# Altium schematic sheet Microcontroller.SchDoc
size A
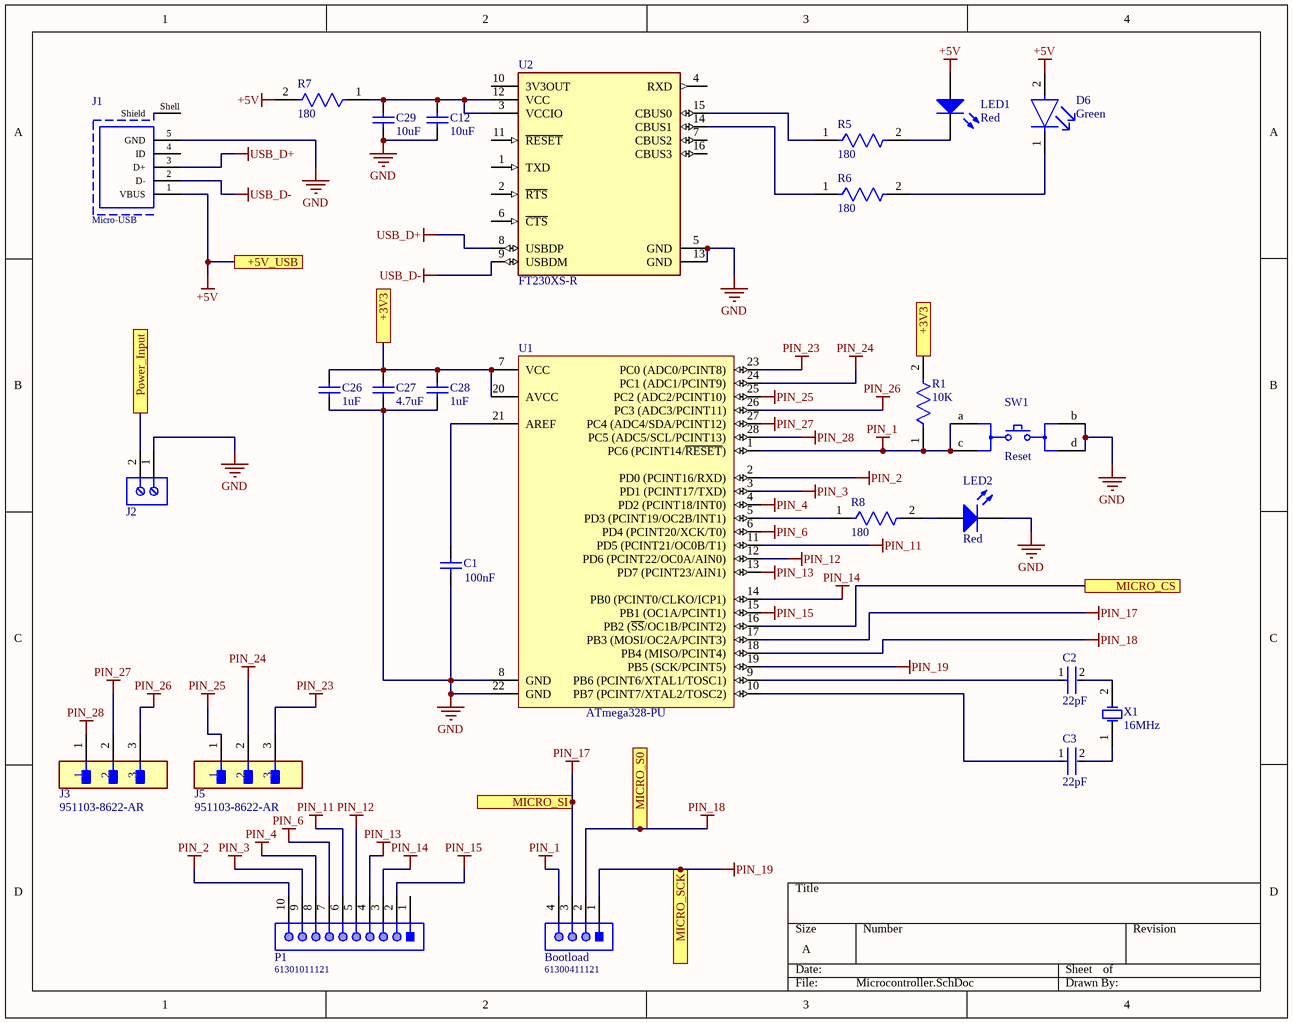
[diagram p0: Microcontroller.SchDoc]

## Parts
Bootload  61300411121  [61300411121]
C1  100nF  [CAPC2013X140X50NL20T25]
C2  22pF  [FP-C0805C-DN-MFG]
C3  22pF  [FP-C0805C-DN-MFG]
C12  10uF  [CAPC2013X115X51LL20T26]
C26  1uF  [CAPC2013X94X50LL20T25]
C27  4.7uF  [CAPC2013X140X50LL20T25]
C28  1uF  [CAPC2013X94X50LL20T25]
C29  10uF  [CAPC2013X115X51LL20T26]
D6  Green  [FP-APTD3216CGCK-MFG]
J1  Micro-USB  [629105150921]
J2  (no value)  [691214110002]
J3  951103-8622-AR  [FP-951103-8622-AR-MFG]
J5  951103-8622-AR  [FP-951103-8622-AR-MFG]
LED1  Red  [0603_A]
LED2  Red  [0603_A]
P1  61301011121  [61301011121]
R1  10K  [FP-CRCW0805-e3-IPC_A]
R5  180  [FP-CR0805-MFG]
R6  180  [FP-CR0805-MFG]
R7  180  [FP-CR0805-MFG]
R8  180  [FP-CR0805-MFG]
SW1  Reset  [FP-ESE-20C421-MFG]
U1  ATmega328-PU  [28P3]
U2  FT230XS-R  [FP-SSOP-16-MFG]
X1  16MHz  [FOX-FOXSDLF160-20_V]

## Ports
+3V3, +5V_USB, MICRO_CS, MICRO_S0, MICRO_SCK, MICRO_SI, Power_Input

## Nets
+5V: D6.2(A) J1.1(VBUS) LED1.2(A) R7.2 ; port +5V_USB
GND: C1.1 C12.1 C26.1 C27.1 C28.1 C29.1 J1.5(GND) J2.1 LED2.1(K) SW1.b SW1.d U1.8(GND) U1.22(GND) U2.5(GND) U2.13(GND)
PIN_1: Bootload.4 R1.1 SW1.a SW1.c U1.1(PC6_(PCINT14/~{RESET}))
PIN_2: P1.10 U1.2(PD0_(PCINT16/RXD))
PIN_3: P1.9 U1.3(PD1_(PCINT17/TXD))
PIN_4: P1.8 U1.4(PD2_(PCINT18/INT0))
PIN_6: P1.7 U1.6(PD4_(PCINT20/XCK/T0))
PIN_11: P1.6 U1.11(PD5_(PCINT21/OC0B/T1))
PIN_12: P1.5 U1.12(PD6_(PCINT22/OC0A/AIN0))
PIN_13: P1.4 U1.13(PD7_(PCINT23/AIN1))
PIN_14: P1.3 U1.14(PB0_(PCINT0/CLKO/ICP1))
PIN_15: P1.2 U1.15(PB1_(OC1A/PCINT1))
PIN_17: Bootload.3 U1.17(PB3_(MOSI/OC2A/PCINT3)) ; port MICRO_SI
PIN_18: Bootload.2 U1.18(PB4_(MISO/PCINT4)) ; port MICRO_S0
PIN_19: Bootload.1 U1.19(PB5_(SCK/PCINT5)) ; port MICRO_SCK
PIN_23: J5.3 U1.23(PC0_(ADC0/PCINT8))
PIN_24: J5.2 U1.24(PC1_(ADC1/PCINT9))
PIN_25: J5.1 U1.25(PC2_(ADC2/PCINT10))
PIN_26: J3.3 U1.26(PC3_(ADC3/PCINT11))
PIN_27: J3.2 U1.27(PC4_(ADC4/SDA/PCINT12))
PIN_28: J3.1 U1.28(PC5_(ADC5/SCL/PCINT13))
USB_D+: J1.3(D+) U2.8(USBDP)
USB_D-: J1.2(D-) U2.9(USBDM)
+3V3: C26.2 C27.2 C28.2 R1.2 U1.7(VCC) U1.20(AVCC) ; port +3V3
MICRO_CS: U1.16(PB2_(~{SS}/OC1B/PCINT2)) ; port MICRO_CS
Power_Input: J2.2 ; port Power_Input
NetC1_2: C1.2 U1.21(AREF)
NetC2_1: C2.1 U1.9(PB6_(PCINT6/XTAL1/TOSC1))
NetC2_2: C2.2 X1.2(X2)
NetC3_1: C3.1 U1.10(PB7_(PCINT7/XTAL2/TOSC2))
NetC3_2: C3.2 X1.1(X1)
NetC12_2: C12.2 C29.2 R7.1 U2.3(VCCIO) U2.12(VCC)
NetD6_1: D6.1(C) R6.2
NetLED1_1: LED1.1(K) R5.2
NetLED2_2: LED2.2(A) R8.2
NetR5_1: R5.1 U2.15(CBUS0)
NetR6_1: R6.1 U2.14(CBUS1)
NetR8_1: R8.1 U1.5(PD3_(PCINT19/OC2B/INT1))

Not connected (* = marked no-connect by the designer): J1 4(ID) Shell(Shield); P1 1; U2 1(TXD) 2(~{RTS}) 4(RXD) 6(~{CTS}) 7(CBUS2) 10(3V3OUT) 11(~{RESET}) 16(CBUS3)

## Library data of the parts
Bootload = CMP-1502-01064-1: THT Vertical Pin Header WR-PHD, Pitch 2.54 mm, Single Row, 4 pins; Manufacturer: Wurth Elektronik; Withstanding Voltage: 500VAC; Rated Current: 3A; Working Voltage: 250VAC; Pin Number: 4; Gender: Male; Contact Resistance: 20mOhm; Pitch: 2.54mm; Manufacturer URL: http://www.we-online.de; Operating Temperature: -40to105degC; Packaging: Bag; Mounting Technology: THT; Package Reference: 61300411121; Datasheet URL: https://katalog.we-online.de/em/datasheet/6130xx11121.pdf; Publisher: WurthElektronik; Part Number: 61300411121; Row Number: Single; Orientation: Vertical
C1 = CMP-2007-04629-1: Part Number: 08055C104K4Z2A; Manufacturer: AVX Interconnect / Elco
C2 C3 = CMP-2007-00448-2: CAP CER 22PF 100V 5% NP0 0805; Manufacturer Part Number: C0805C220J1GACTU; Manufacturer: KEMET; Material: Ceramic; Temperature Coefficient: 30ppm/°C; Tolerance: 0.05; Temperature Characteristic: C0G; Value: 22 pF; RoHS: TRUE; ComponentLink2URL: https://content.kemet.com/datasheets/KEM_C1003_C0G_SMD.pdf; Capacitance: 22 pF; Mouser Description: Multilayer Ceramic Capacitor, C Series, 22 Pf, - 5%, C0g / Np0, 100 V, 0805 [2012 Metric] Rohs Compliant: Yes; Digikey Description: CAP CER 22PF 100V 5% NP0 0805; Octopart: https://octopart.com/c0805c220j1gactu-kemet-3791395; Device Class L3: Ceramic Capacitors; Device Class L2: Capacitors; Voltage Rating: 100 V; Temperature Range Low: -55°C; Ipc Land Pattern Name: CAPC200125X78; Lead Free: Yes; ComponentLink2Description: Datasheet; Category: Cap; Temperature: -55°C to +125°C; Package: C0805C-DN; Device Class L1: Passive Components; Temperature Range High: +125°C; Height: 0.88mm; Automotive: No
C12 C29 = CMP-2007-04884-1: Manufacturer: AVX Interconnect / Elco; Part Number: 08056C106KAT2A
C26 C28 = CMP-2007-04237-1: Manufacturer: AVX Interconnect / Elco; Part Number: 08053C105K4T2A
C27 = CMP-1036-04896-2: Manufacturer: AVX Interconnect / Elco; Part Number: 08053D475MAT2A
D6 = CMP-2000-05792-2: LED GREEN CLEAR 2SMD; Forward Voltage: 2.1V; Forward Current: 20mA; Luminous Intensity: 300mcd; Number of LEDs: 1; Dominant Wavelength: 570nm; Viewing Angle: 50°; Lead Free: Lead Free; Lens Color: Clear; Mount: Surface Mount; Package Quantity: 2000; Height: 1.8mm; Number of Pins: 2; Test Current: 20mA; Case Code (Metric): 3216; Case/Package: 1206; Case Code (Imperial): 1206; Illumination Color: Green; Color: Green; Width: 1.6mm; Packaging: Tape and Reel; Min Operating Temperature: -40°C; Lens Style: Clear; Max Operating Temperature: 85°C; Length: 3.2mm
J1 = CMP-1502-03249-1: Micro USB 2.0 Type AB Receptacle WR-COM, Horizontal, SMT; Manufacturer: Wurth Elektronik; Rated Current: 1.8A; Contact Resistance: 30mOhm; Working Voltage: 30VAC; Publisher: WurthElektronik; Part Number: 629105150921; Operating Temperature: -40to85degC; Gender: Receptacle; Packaging: TapeandReel; Connector Type: MicroUSB2.0TypeAB; Datasheet URL: https://katalog.we-online.de/em/datasheet/629105150921.pdf; Mounting Technology: SMT; Orientation: Horizontal; Package Reference: 629105150921; Manufacturer URL: http://www.we-online.de
J2 = CMP-1502-02464-1: Serie 2141 - 3.50 mm Horizontal Entry Modular with Rising Cage Clamp WR-TBL, 2 pin; Manufacturer: Wurth Elektronik; Pin Number: 2; Pitch: 3.50mm; Datasheet URL: http://katalog.we-online.de/em/datasheet/6912141100xx.pdf; Packaging: Box; Mounting Technology: THT; Package Reference: 691214110002; Manufacturer URL: http://www.we-online.de; Part Number: 691214110002; Publisher: WurthElektronik; Operating Temperature: -40to105degC
J3 J5 = CMP-05379-000003-1: CONN HEADER VERT 3POS 2MM; Manufacturer: 3M; Conn Gender: Male; Current Rating: 2A; Number Of Contacts: 3; Conn Orientation: Straight; Digikey Description: CONN HEADER VERT 3POS 2MM; Device Class L3: unset; Category: Conn; Height: 6.3mm; Manufacturer Part Number: 951103-8622-AR; RoHS: TRUE; Contact Material: Gold,Nickel; ComponentLink2Description: Datasheet; Temperature Range Low: -55°C; Device Class L1: Connectors; Pitch: 2mm; Mouser Description: Header; PinStrip; CopperAlloy; HighTempThermoplastic; 3Cnts; 1A; RtAngle; 951Series; Octopart: https://octopart.com/951103-8622-ar-3m-14400669; Package: 951103-8622-AR; Lead Free: Yes; Device Class L2: Headers and Wire Housings; Temperature Range High: +125°C; ComponentLink2URL: http://multimedia.3m.com/mws/media/1400506O/3m-pin-strip-header-951-series-78-5100-2653-3.pdf; Automotive: No; Temperature: -55°C to +125°C; Number Of Rows: 1
LED1 LED2 = CMP-1426-00001-1: SMD mono-color Chip LED, WL-SMCW, Red; Manufacturer: Wuerth Elektronik; PartNumber: 150060RS75000; Color: Red; PackageReference: 0603_A; ComponentLink2URL: http://katalog.we-online.com/led/datasheet/150060RS75000.pdf; ComponentLink1URL: http://www.we-online.com; ComponentLink1Description: Manufacturer URL; ComponentLink2Description: Datasheet
P1 = CMP-1502-01082-1: THT Vertical Pin Header WR-PHD, Pitch 2.54 mm, Single Row, 10 pins; Manufacturer: Wurth Elektronik; Contact Resistance: 20mOhm; Rated Current: 3A; Pitch: 2.54mm; Gender: Male; Pin Number: 10; Working Voltage: 250VAC; Withstanding Voltage: 500VAC; Manufacturer URL: http://www.we-online.de; Operating Temperature: -40to105degC; Datasheet URL: https://katalog.we-online.de/em/datasheet/6130xx11121.pdf; Row Number: Single; Orientation: Vertical; Part Number: 61301011121; Packaging: Bag; Package Reference: 61301011121; Mounting Technology: THT; Publisher: WurthElektronik
R1 = CMP-2001-04908-2: RES Thick Film, 10kΩ, 1%, 0.125W, 100ppm/°C, 0805; Resistance: 10kR; Voltage Rating (DC): 150V; Power Rating: 125mW; Weight: 0.000194oz; Package Quantity: 5000; Military Standard: Not; Max Operating Temperature: 155°C; Temperature Coefficient: 100ppm/°C; Contact Plating: Tin; Width: 1.25mm; Height: 0.45mm; Radiation Hardening: No; Tolerance: 1%; Min Operating Temperature: -55°C; Voltage Rating: 150V; Length: 2mm; Depth: 1.25mm; Termination: SMD/SMT; Packaging: Tape and Reel; Case/Package: 0805; Case Code (Metric): 2012; Lead Free: Lead Free; Case Code (Imperial): 0805; Composition: Thick Film
R5-R8 = CMP-07231-003557-1: Thick Film Chip Resistors 0805 180Ω 0.125W 5% 200ppm/°C; Voltage Rating: 150V; Power Rating: 125mW; Resistance: 180R; Radiation Hardening: No; Military Standard: Not; Case Code (Imperial): 0805; Length: 2mm; Termination: SMD/SMT; Thickness: 508um; Case Code (Metric): 2012; Packaging: Tape and Reel; Temperature Coefficient: 200ppm/°C; Max Operating Temperature: 155°C; Package Quantity: 5000; Case/Package: 0805; Contact Plating: Tin; Tolerance: 5%; Width: 1.25mm; Composition: Thick Film; Depth: 1.25mm; Mount: Surface Mount; Height: 0.5mm; Min Operating Temperature: -55°C
SW1 = CMP-05613-000006-1: SWITCH PUSH SPST-NO 0.1A 14V; Current Rating: 100mA; Switch Function: Off-Mom; Throw Configuration: SPST; Actuator Type: Lever; Operating Force: 4N; Actuator Length: 5.5mm; Series: ESE20C; Package Quantity: 1200; Radiation Hardening: No; Max Voltage Rating (DC): 14V; Voltage Rating (DC): 14V; Max Operating Temperature: 80°C; Lead Free: Lead Free; Mount: Through Hole; Termination: PC Pin; Packaging: Bulk; Min Operating Temperature: -30°C; RoHS Compliant: Yes; Contact Current Rating: 100mA; REACH SVHC: No SVHC; Orientation: Straight
U1 = CMP-0095-00015-2: 8-bit AVR Microcontroller, 32KB Flash, 1KB EEPROM, 2KB SRAM, 28-pin PDIP, Industrial Grade (-40°C to 85°C); ComponentLink3Description: ATmega48A/48PA/88A/88PA/168A/168PA/328/328P Summary; RevisionNote: DatasheetVersion updated. URLs added.; DatasheetVersion: revD, May-2011; ComponentLink1URL: http://www.atmel.com/; PackageVersion: revB, Sep-2001; PackageDescription: 28-lead (0.300"/7.62mm Wide) Plastic Dual Inline Package (PDIP); PackageReference: 28P3; ComponentLink1Description: Manufacturer URL; ComponentLink2Description: ATmega48A/48PA/88A/88PA/168A/168PA/328/328P Datasheet; ComponentLink3URL: http://www.atmel.com/dyn/resources/prod_documents/8271S.pdf; ComponentLink2URL: http://www.atmel.com/dyn/resources/prod_documents/8271.pdf
U2 = CMP-0248-00026-3: IC USB SERIAL BASIC UART 16SSOP; Min Supply Voltage: 2.97V; Data Rate: 12Mbps; Operating Supply Voltage: 5V; Number of Channels: 1; Max Supply Voltage: 5.5V; Operating Supply Current: 8mA; Case/Package: SSOP; Length: 5mm; Interface: UART; Mount: Surface Mount; Number of Pins: 16; Packaging: Tape and Reel; Weight: 0.004586oz; Min Operating Temperature: -40°C; Width: 0.157inch; Height: 0.059inch; Package Quantity: 3000; Max Operating Temperature: 85°C
X1 = CMP-1749-00001-1: Resistance Weld SMD Crystal, 16 MHz, +/- 30 ppm, 20 pF, -20 to 70 degC, 2-Pin SMD, RoHS, Tape and Reel; Output Current: 3 mA; Case\Package: SOT-553-6; Min Supply Voltage (DC): 4 V; Max Supply Voltage: 3.3 V; Min Supply Voltage: 1.4 V; Interface: I2C; Max Supply Voltage (DC): 6 V; ComponentLink2Description: Datasheet; REACH SVHC: No SVHC; ComponentLink1URL: http://www.foxonline.com/; ComponentLink2URL: http://foxonline.com/pdfs/hc49sdlf.pdf; Pins: 6; Packaging: Cut Tape; ComponentLink1Description: Manufacturer URL; Weight: 9.9E-05 oz; Length: 1.6 mm; RoHSCompliant: true; Min Operating Temperature: -55 degC; Radiation Hardening: No; PackageDescription: 2-Pin Surface Mount Device, Body 5 x 11.7 mm, Height 4.5 mm; Package Quantity: 1; Width: 1.2 mm; DatasheetVersion: Mar-15; Max Operating Temperature: 150 degC; Mount: Surface Mount; PackageReference: FOX-FOXSDLF160-20; Height: 0.55 mm